# Altium project open-vindriktning-pcb.PrjPcb
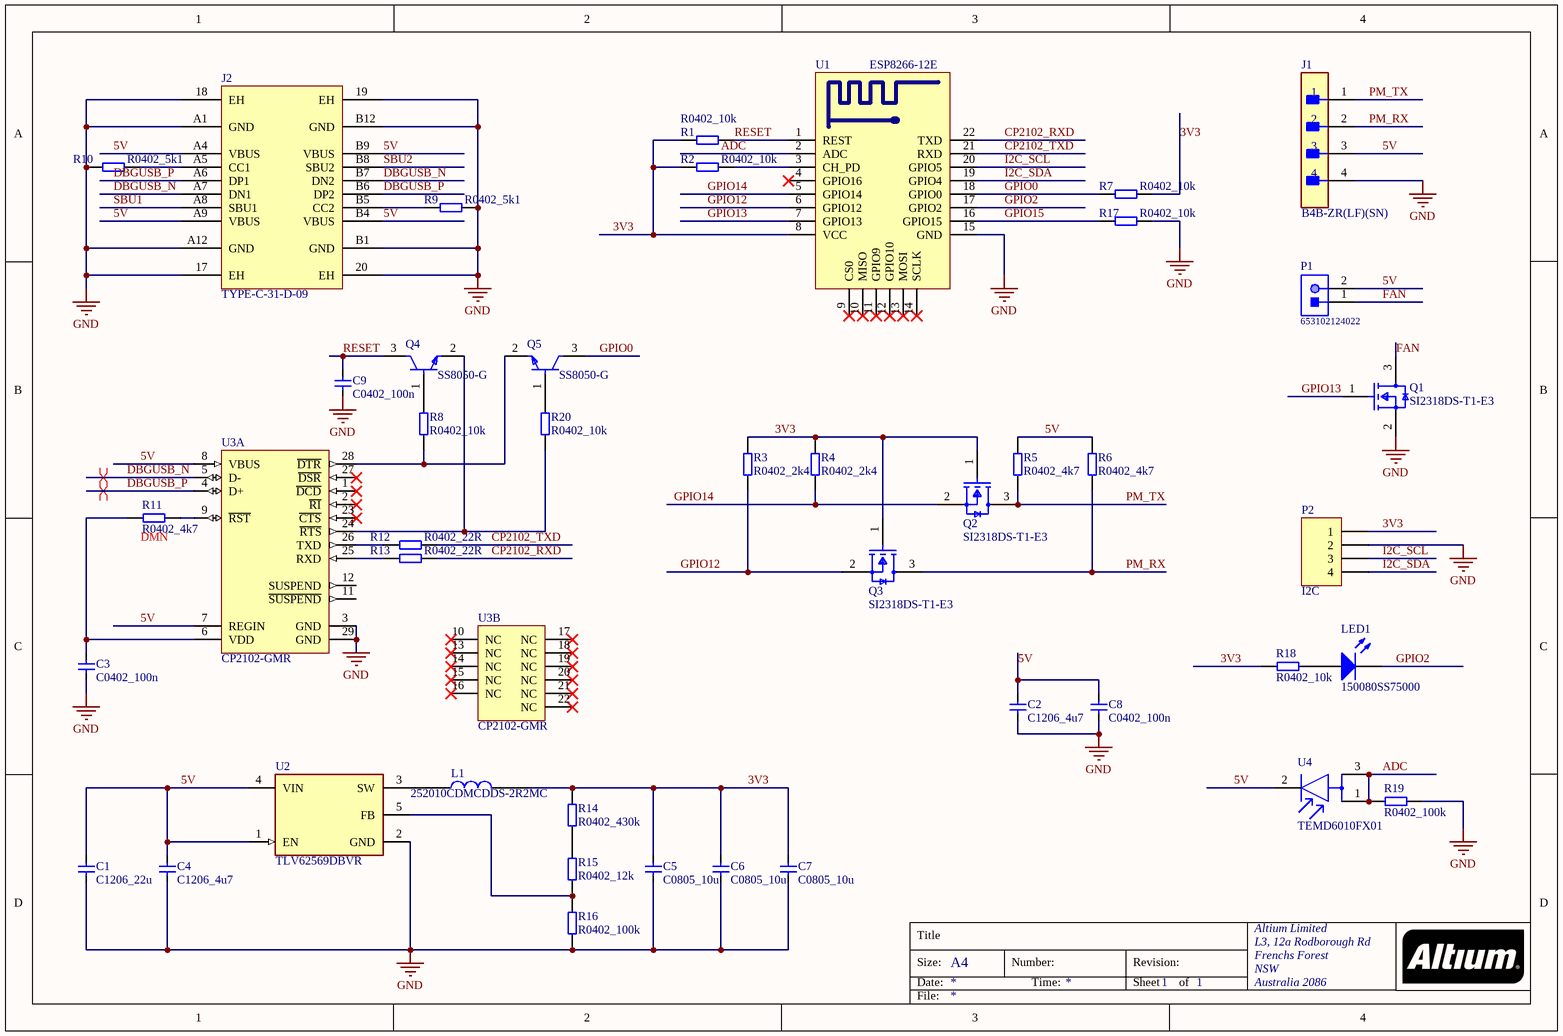
[diagram p0: Main.SchDoc]
1 sheet, 44 parts. Net scope: global (net labels, ports and power ports of the same name join across sheets).
Board file: PCB1.PcbDoc

## Sheet Main.SchDoc
size A4; Organization: Altium Limited; Address1: L3, 12a Rodborough Rd; Address2: Frenchs Forest; Address3: NSW; Address4: Australia 2086; SheetNumber: 1; SheetTotal: 1

### Parts
C1  C1206_22u  [C1206]
C2  C1206_4u7  [C1206]
C3  C0402_100n  [C0402]
C4  C1206_4u7  [C1206]
C5  C0805_10u  [C0805]
C6  C0805_10u  [C0805]
C7  C0805_10u  [C0805]
C8  C0402_100n  [C0402]
C9  C0402_100n  [C0402]
J1  B4B-ZR(LF)(SN)  [FP-B4B-ZR_LF_SN-MFG]
J2  TYPE-C-31-D-09  [New footprint 1]
L1  252010CDMCDDS-2R2MC  [INDC2520X10N]
LED1  150080SS75000  [0805_A]
P1  653102124022  [653102124022]
P2  I2C  [HDR1X4]
Q1  SI2318DS-T1-E3  [FP-S-03946-MFG]
Q2  SI2318DS-T1-E3  [FP-S-03946-MFG]
Q3  SI2318DS-T1-E3  [FP-S-03946-MFG]
Q4  SS8050-G  [FP-SS8050-G-MFG]
Q5  SS8050-G  [FP-SS8050-G-MFG]
R1  R0402_10k  [R0402]
R2  R0402_10k  [R0402]
R3  R0402_2k4  [R0402]
R4  R0402_2k4  [R0402]
R5  R0402_4k7  [R0402]
R6  R0402_4k7  [R0402]
R7  R0402_10k  [R0402]
R8  R0402_10k  [R0402]
R9  R0402_5k1  [R0402]
R10  R0402_5k1  [R0402]
R11  R0402_4k7  [R0402]
R12  R0402_22R  [R0402]
R13  R0402_22R  [R0402]
R14  R0402_430k  [R0402]
R15  R0402_12k  [R0402]
R16  R0402_100k  [R0402]
R17  R0402_10k  [R0402]
R18  R0402_10k  [R0402]
R19  R0402_100k  [R0402]
R20  R0402_10k  [R0402]
U1  ESP8266-12E  [ESP_12E]
U2  TLV62569DBVR  [FP-DBV0005A-MFG]
U3  CP2102-GMR  [SLAB-QFN-28-3125x3125TP_M]  (parts A,B of 2)
U4  TEMD6010FX01  [FP-6_541-5080_01-4-MFG]

### Nets
GND: C1.2 C2.2 C3.2 C4.2 C5.2 C6.2 C7.2 C8.2 C9.2 J1.4 J2.17(EH) J2.18(EH) J2.19(EH) J2.20(EH) J2.A1(GND) J2.A12(GND) J2.B1(GND) J2.B12(GND) P2.2 Q1.2(S) R9.2 R10.1 R16.1 R17.2 R19.2 U1.15(GND) U2.2(GND) U3.3(GND) U3.29(GND)
3V3: C5.1 C6.1 C7.1 L1.2 P2.1 Q2.1(G) Q3.1(G) R1.1 R2.1 R3.2 R4.2 R7.2 R14.2 R18.1 U1.8(VCC)
5V: C1.1 C2.1 C4.1 C8.1 J1.3 J2.A4(VBUS) J2.A9(VBUS) J2.B4(VBUS) J2.B9(VBUS) P1.2 R5.2 R6.2 U2.1(EN) U2.4(VIN) U3.7(REGIN) U3.8(VBUS) U4.2(C)
ADC: R19.1 U1.2(ADC) U4.1(A) U4.3(A)
CP2102_RXD: R13.2 U1.22(TXD)
CP2102_TXD: R12.2 U1.21(RXD)
DBGUSB_N: J2.A7(DN1) J2.B7(DN2) U3.5(D-)
DBGUSB_P: J2.A6(DP1) J2.B6(DP2) U3.4(D+)
FAN: P1.1 Q1.3(D)
GPIO0: Q5.3(C) R7.1 U1.18(GPIO0)
GPIO2: LED1.1(K) U1.17(GPIO2)
GPIO12: Q3.2(S) R3.1 U1.6(GPIO12)
GPIO13: Q1.1(G) U1.7(GPIO13)
GPIO14: Q2.2(S) R4.1 U1.5(GPIO14)
GPIO15: R17.1 U1.16(GPIO15)
I2C_SCL: P2.3 U1.20(GPIO5)
I2C_SDA: P2.4 U1.19(GPIO4)
PM_RX: J1.2 Q3.3(D) R6.1
PM_TX: J1.1 Q2.3(D) R5.1
RESET: C9.1 Q4.3(C) R1.2 U1.1(REST)
SBU1: J2.A8(SBU1)
SBU2: J2.B8(SBU2)
NetC3_1: C3.1 R11.1 U3.6(VDD)
NetJ2_A5: J2.A5(CC1) R10.2
NetJ2_B5: J2.B5(CC2) R9.1
NetL1_1: L1.1 U2.3(SW)
NetLED1_2: LED1.2(A) R18.2
NetQ4_1: Q4.1(B) R8.2
NetQ4_2: Q4.2(E) R20.1 U3.24(~{RTS})
NetQ5_1: Q5.1(B) R20.2
NetQ5_2: Q5.2(E) R8.1 U3.28(~{DTR})
NetR2_2: R2.2 U1.3(CH_PD)
NetR11_2: R11.2 U3.9(~{RST})
NetR12_1: R12.1 U3.26(TXD)
NetR13_1: R13.1 U3.25(RXD)
NetR14_1: R14.1 R15.2
NetR15_1: R15.1 R16.2 U2.5(FB)

Not connected (* = marked no-connect by the designer): U1 4(GPIO16)* 9(CS0)* 10(MISO)* 11(GPIO9)* 12(GPIO10)* 13(MOSI)* 14(SCLK)*; U3 1(~{DCD})* 2(~{RI})* 10(NC)* 11(~{SUSPEND}) 12(SUSPEND) 13(NC)* 14(NC)* 15(NC)* 16(NC)* 17(NC)* 18(NC)* 19(NC)* 20(NC)* 21(NC)* 22(NC)* 23(~{CTS})* 27(~{DSR})*

### Layout directives
differential pair: DBGUSB_N, DBGUSB_P

### Notes on the sheet
- (near R11) DMN
- Title
- Size:
- Date:
- A4
- Number:
- Time:
- Revision:
- Sheet
- of
- File:

### Library data of the parts
C1 = CMP-003-0098-1: Manufacturer 1: Kemet; Manufacturer Part Number 1: C1206C226M8PAC; Hidden Value: C226; Dielectric: X5R; Tolerance: 0.2%; Voltage Rating DC: 10V; Value: 22u; Pin Count: 2; Part Number: C1206_22u; Component Type: Standard
C2 C4 = CMP-003-0093-1: Manufacturer 1: Kemet; Manufacturer Part Number 1: C1206C475K4RAC; Voltage Rating DC: 16V; Dielectric: X7R; Tolerance: 0.1%; Hidden Value: C475; Value: 4u7; Component Type: Standard; Part Number: C1206_4u7; Pin Count: 2
C3 C8 C9 = CMP-003-0006-1: Manufacturer 1: Kemet; Manufacturer Part Number 1: C0402C104K4RACTU; Dielectric: X7R; Voltage Rating DC: 16V; Value: 100n; Tolerance: 0.1%; Part Number: C0402_100n; Pin Count: 2; Component Type: Standard
C5-C7 = CMP-003-0002-1: C0805; Manufacturer 1: Kemet; Tolerance: 0.05%; Value: _; Dielectric: X7R; Voltage Rating DC: 25V; Part Number: C0805; Pin Count: 2; Component Type: Standard
J1 = CMP-17439-000033-1: CONN HEADER VERT 4POS 1.5MM; Max Current Rating: 1A; Max Voltage Rating (AC): 50V; Contact Resistance: 30mR; Body Plating: Tin; Number of Positions: 4; Connector Type: Male Pin; Panel Thickness: 3.5mm; Gender: Male; Insulation Resistance: 500MR; Termination: Solder; Fastening Type: Detent; Housing Material: Polyamide; Voltage Rating (DC): 50V; REACH SVHC: No SVHC; Lead Free: Lead Free; Min Operating Temperature: -25°C; Depth: 3.5mm; Contact Mating Length: 0.094inch; Material: Nylon; Max Operating Temperature: 85°C; Mount: Through Hole; Number of Rows: 1; Orientation: Straight; Current Rating: 1A; Flammability Rating: UL94 V-0; Housing Color: Beige; Length: 7.5mm; Packaging: Bulk; Voltage Rating: 50V; Voltage Rating (AC): 50V; Number of Contacts: 4; Lead Pitch: 1.5mm; Series: ZH; Color: Natural; Contact Plating: Tin; Pitch: 1.5mm; Contact Type: Male Pin; Contact Material: Brass
J2 = CMP-011-000001-1
L1 = CMP-00003-2: Fixed Ind 2.2UH 2.5A 97 Mohm SMD
LED1 = CMP-1426-00010-1: SMD mono-color Chip LED, WL-SMCW, Super Red; Manufacturer: Wuerth Elektronik; PackageReference: 0805_A; ComponentLink2URL: http://katalog.we-online.com/led/datasheet/150080SS75000.pdf; ComponentLink1URL: http://www.we-online.com; Color: Super Red; ComponentLink2Description: Datasheet; ComponentLink1Description: Manufacturer URL; PartNumber: 150080SS75000
P1 = CMP-1502-00757-1: Male Shrouded Header WR-WTB, SMT, Vertical, pitch 1.25 mm, 1 x 2 position; Manufacturer: Wurth Elektronik; Contact Resistance: 20mOhm; Position: 1x2; Working Voltage: 125VAC; Pitch: 1.25mm; Publisher: WurthElektronik; Package Reference: 653102124022; Mounting Technology: SMT; Manufacturer URL: http://www.we-online.de; Datasheet URL: https://katalog.we-online.de/em/datasheet/6531xx124022.pdf; Gender: Male; Part Number: 653102124022; Packaging: TapeandReel; Orientation: Vertical; Operating Temperature: -40to85degC
P2 = Header 4: Header, 4-Pin; LatestRevisionDate: 17-Jul-2002; LatestRevisionNote: Re-released for DXP Platform.; Publisher: Altium Limited
Q1-Q3 = CMP-02550-000015-1: MOSFET N-CH 40V 3A SOT23-3; Manufacturer: Vishay; Input Capacitace At Vds: 540pF @ 20V; Turn On Delay Time: 5ns; Standoff Height: 0.01mm; Rthja Max: 120°C/W; Power Dissipation: 0.75W; Number Of Channels: 1; Max Junction Temp: +150°C; Gate Charge At Vgs: 10nC @ 10V; Pulse Drain Current: 16A; Turn Off Delay Time: 20ns; Threshold Vgs Min: 1V; Depletion Mode: False; Max Forward Diode Voltage: 1.2V; Drain To Source Resistance: 0.036Ω; Gate To Source Voltage: 20V; Transconductance: 11S; Threshold Vgs Max: 3V; Typ Forward Diode Voltage: 0.8V; Lead Free: Yes; Temperature Range Low: -55°C; Drain To Source Voltage: 40V; Category: Trans; Number Of N Channels: 1; Temperature Range High: +150°C; RoHS: TRUE; Digikey Description: MOSFET N-CH 40V 3A SOT23-3; Mouser Description: MOSFET 40V 6A; Manufacturer Part Number: SI2318DS-T1-E3; Drain To Source Breakdown Voltage: 40V; ComponentLink2Description: Datasheet; Device Class L1: Discrete Semiconductors; Temperature: -55°C to +150°C; Automotive: No; Package: S-03946; Device Class L3: MOSFETs; Height: 1.12mm; Octopart: https://octopart.com/si2318ds-t1-e3-vishay-40866469; Continuous Drain Current: 3A; Device Class L2: Transistors; ComponentLink2URL: http://www.vishay.com/docs/72322/72322.pdf
Q4 Q5 = CMP-20235-000001-1: NPN TRANSISTOR 1.5A 40V SOT-23 R; Transition Frequency: 100MHz; Max Breakdown Voltage: 25V; Collector Emitter Voltage (VCEO): 400mV; Max Power Dissipation: 300mW; Max Collector Current: 1.5A; Case/Package: TO-236-3; Packaging: Tape and Reel; RoHS Compliant: Yes; Mount: Surface Mount; Collector Emitter Breakdown Voltage: 25V
R1 R2 R7 R8 R17 R18 R20 = CMP-004-0443-1: Manufacturer 1: Vishay; Manufacturer Part Number 1: CRCW040210K0FKED; Power Rating: 62,5mW; Value: 10k; Tolerance: 1%; Part Number: R0402_10k; Component Type: Standard; Pin Count: 2
R3 R4 = CMP-004-0428-1: Manufacturer 1: Vishay; Manufacturer Part Number 1: CRCW04022K40FKED; Value: 2k4; Power Rating: 62,5mW; Tolerance: 1%; Part Number: R0402_2k4; Pin Count: 2; Component Type: Standard
R5 R6 R11 = CMP-004-0435-1: Manufacturer Part Number 1: CRCW04024K70FKED; Manufacturer 1: Vishay; Tolerance: 1%; Power Rating: 62,5mW; Value: 4k7; Pin Count: 2; Component Type: Standard; Part Number: R0402_4k7
R9 R10 = CMP-004-0436-1: Manufacturer 1: Vishay; Manufacturer Part Number 1: CRCW04025K10FKED; Value: 5k1; Tolerance: 1%; Power Rating: 62,5mW; Pin Count: 2; Component Type: Standard; Part Number: R0402_5k1
R12 R13 = CMP-004-0379-1: Manufacturer 1: Vishay; Manufacturer Part Number 1: CRCW040222R0FKED; Value: 22R; Power Rating: 62,5mW; Tolerance: 1%; Component Type: Standard; Pin Count: 2; Part Number: R0402_22R
R14 = CMP-004-0482-1: Manufacturer Part Number 1: CRCW0402430KFKED; Manufacturer 1: Vishay; Tolerance: 1%; Value: 430k; Power Rating: 62,5mW; Component Type: Standard; Pin Count: 2; Part Number: R0402_430k
R15 = CMP-004-0445-1: Manufacturer 1: Vishay; Manufacturer Part Number 1: CRCW040212K0FKED; Power Rating: 62,5mW; Value: 12k; Tolerance: 1%; Part Number: R0402_12k; Component Type: Standard; Pin Count: 2
R16 R19 = CMP-004-0467-1: Manufacturer Part Number 1: CRCW0402100KFKED; Manufacturer 1: Vishay; Tolerance: 1%; Value: 100k; Power Rating: 62,5mW; Component Type: Standard; Part Number: R0402_100k; Pin Count: 2
U1 = ESP8266-12E: 串口 WIFI模块，ESP-12E; BOM名称: WIFI模块; 版权归属: 源创客; 学习资源: www.ooocke.com
U2 = CMP-04918-000387-1: IC REG BUCK ADJ 2A SOT23-5; Output Configuration: Positive; Min Output Voltage: 600mV; Max Output Voltage: 5.5V; Switching Frequency: 1.5MHz; Output Type: Adjustable; Synchronous Rectifier: Yes; Min Input Voltage: 2.5V; Output Current: 2A; Mount: Surface Mount; Min Operating Temperature: -40°C; Max Operating Temperature: 125°C; RoHS Compliant: Yes; Max Input Voltage: 5.5V; Case/Package: SOT-23-5; Packaging: Cut Tape
U3 = CMP-2000-04924-1: Single-Chip USB to URAT Bridge, 3.3 V, -40 to 85 degC, 28-Pin QFN, RoHS, Tape and Reel; Manufacturer: Silicon Labs; Interface Circuit Standard 1: RS-232; Transmitter and Receiver FIFO Counter: No; Supply Current: 26mA; Operating Supply Voltage (Min): 3V; Operating Supply Voltage (Typ): 3.3V; Data Rate: 1000kbps; Operating Supply Voltage (Max): 3.6V; Number of Channels: 1; Package URL: http://www.silabs.com/Support%20Documents/TechnicalDocs/C8051T61x.pdf; Operating Temperature (Max): 85C; Datasheet URL: http://www.mouser.com/ds/2/368/CP2102-9-247052.pdf; Operating Temperature Classification: Industrial; Operating Temperature (Min): -40C; Package Description: 28-Pin Quad-Flat No-Leads Package, Body 5 x 5 mm, Pitch 0.5 mm; Manufacturer URL: http://www.silabs.com/; Rad Hardened: No; Package Reference: QFN-28; Pin Count: 28; Packaging: TapeandReel; Mounting: SurfaceMount; Package Type: QFNEP; Datasheet Version: Rev. 1.6, 12/2013
U4 = CMP-02531-000006-1: SENSOR PHOTODIODE 540NM SMD; Diode Type: PIN; Max Power Dissipation: 100mW; Dark Current: 2nA; Max Reverse Voltage (DC): 16V; Viewing Angle: 120°; Height: 1.05mm; Lead Free: Lead Free; Reverse Voltage (DC): 16V; Package Quantity: 3000; Number of Pins: 3; RoHS Compliant: Yes; Series: TEMDxxxxFX01; Max Operating Temperature: 100°C; Packaging: Tape and Reel; Radiation Hardening: No; Reverse Breakdown Voltage: 16V; Mount: Surface Mount; Width: 4mm; Wavelength: 540nm; Case/Package: 1206; Min Operating Temperature: -40°C; Power Dissipation: 100mW; Length: 2mm